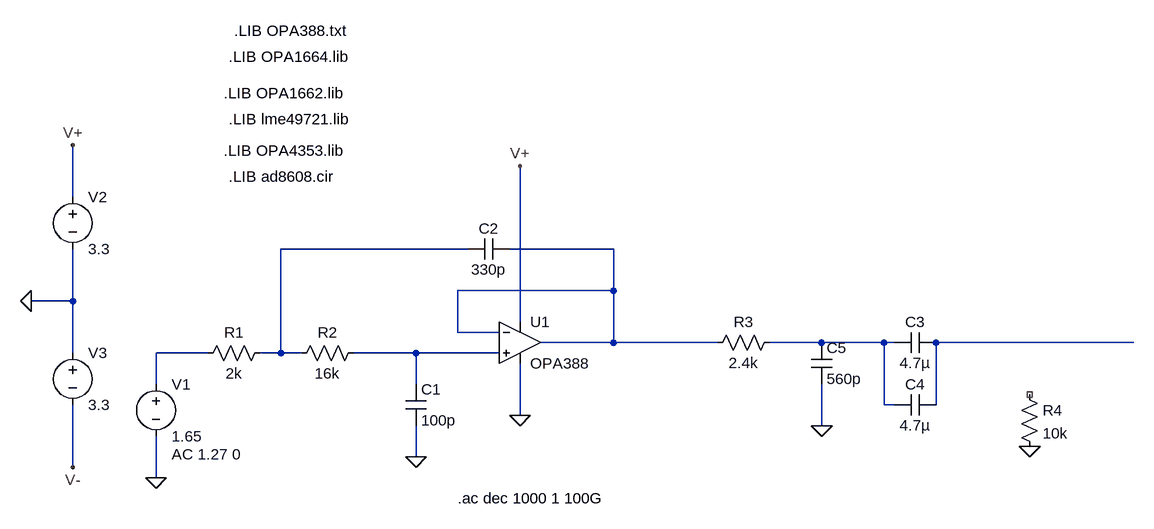
[diagram p0: schematic 120kHz.asc]
120kHz.asc, the LTspice schematic file:
Version 4
SHEET 1 1524 680
WIRE -112 -64 -112 -144
WIRE 496 16 208 16
WIRE 720 16 560 16
WIRE 720 80 720 16
WIRE 720 80 480 80
WIRE -112 96 -112 16
WIRE -112 96 -176 96
WIRE 576 128 576 -112
WIRE 480 144 480 80
WIRE 544 144 480 144
WIRE 720 160 720 80
WIRE 720 160 608 160
WIRE 880 160 720 160
WIRE 1040 160 960 160
WIRE 1136 160 1040 160
WIRE 1152 160 1136 160
WIRE 1520 160 1216 160
WIRE -112 176 -112 96
WIRE 96 176 16 176
WIRE 208 176 208 16
WIRE 208 176 176 176
WIRE 240 176 208 176
WIRE 416 176 320 176
WIRE 544 176 416 176
WIRE 16 224 16 176
WIRE 416 224 416 176
WIRE 1136 256 1136 160
WIRE 1152 256 1136 256
WIRE 1216 256 1216 160
WIRE 576 272 576 192
WIRE 1040 288 1040 224
WIRE 416 336 416 288
WIRE -112 352 -112 256
WIRE 16 368 16 304
FLAG 416 336 0
FLAG -112 -144 V+
FLAG 16 368 0
FLAG 576 -112 V+
FLAG 1040 288 0
FLAG -176 96 0
FLAG -112 352 V-
FLAG 576 272 0
FLAG 1360 320 0
SYMBOL res 192 160 R90
WINDOW 0 0 56 VBottom 2
WINDOW 3 32 56 VTop 2
SYMATTR InstName R1
SYMATTR Value 2k
SYMBOL res 336 160 R90
WINDOW 0 0 56 VBottom 2
WINDOW 3 32 56 VTop 2
SYMATTR InstName R2
SYMATTR Value 16k
SYMBOL cap 400 224 R0
SYMATTR InstName C1
SYMATTR Value 100p
SYMBOL Opamps\\opamp2 576 96 R0
SYMATTR InstName U1
SYMATTR Value OPA388
SYMBOL cap 560 0 R90
WINDOW 0 0 32 VBottom 2
WINDOW 3 32 32 VTop 2
SYMATTR InstName C2
SYMATTR Value 330p
SYMBOL voltage 16 208 R0
WINDOW 123 24 124 Left 2
WINDOW 39 0 0 Left 2
SYMATTR Value2 AC 1.27 0
SYMATTR InstName V1
SYMATTR Value 1.65
SYMBOL voltage -112 -80 R0
SYMATTR InstName V2
SYMATTR Value 3.3
SYMBOL cap 1216 144 R90
WINDOW 0 0 32 VBottom 2
WINDOW 3 32 32 VTop 2
SYMATTR InstName C3
SYMATTR Value 4.7µ
SYMBOL cap 1216 240 R90
WINDOW 0 0 32 VBottom 2
WINDOW 3 32 32 VTop 2
SYMATTR InstName C4
SYMATTR Value 4.7µ
SYMBOL res 976 144 R90
WINDOW 0 0 56 VBottom 2
WINDOW 3 32 56 VTop 2
SYMATTR InstName R3
SYMATTR Value 2.4k
SYMBOL cap 1024 160 R0
SYMATTR InstName C5
SYMATTR Value 560p
SYMBOL voltage -112 160 R0
SYMATTR InstName V3
SYMATTR Value 3.3
SYMBOL res 1344 224 R0
SYMATTR InstName R4
SYMATTR Value 10k
TEXT 120 -136 Left 2 !.LIB OPA4353.lib
TEXT 128 -96 Left 2 !.LIB ad8608.cir
TEXT 480 400 Left 2 !.ac dec 1000 1 100G
TEXT 120 -224 Left 2 !.LIB OPA1662.lib
TEXT 128 -184 Left 2 !.LIB lme49721.lib
TEXT 128 -280 Left 2 !.LIB OPA1664.lib
TEXT 136 -320 Left 2 !.LIB OPA388.txt

The netlist it stands for:
* 120kHz.asc
R1 N001 N005 2k
R2 N006 N001 16k
C1 N006 0 100p
XU1 N006 N002 V+ 0 N002 OPA388  ; pins In+ In- V+ V- OUT
C2 N002 N001 330p
V1 N005 0 1.65 AC 1.27 0
V2 V+ 0 3.3
C3 N004 N003 4.7µ
C4 N004 N003 4.7µ
R3 N003 N002 2.4k
C5 N003 0 560p
V3 0 V- 3.3
R4 NC_01 0 10k
.LIB OPA4353.lib
.LIB ad8608.cir
.ac dec 1000 1 100G
.LIB OPA1662.lib
.LIB lme49721.lib
.LIB OPA1664.lib
.LIB OPA388.txt
.backanno
.end